# EAGLE design NovaHammyRevXD (EAGLE 7.4.0)
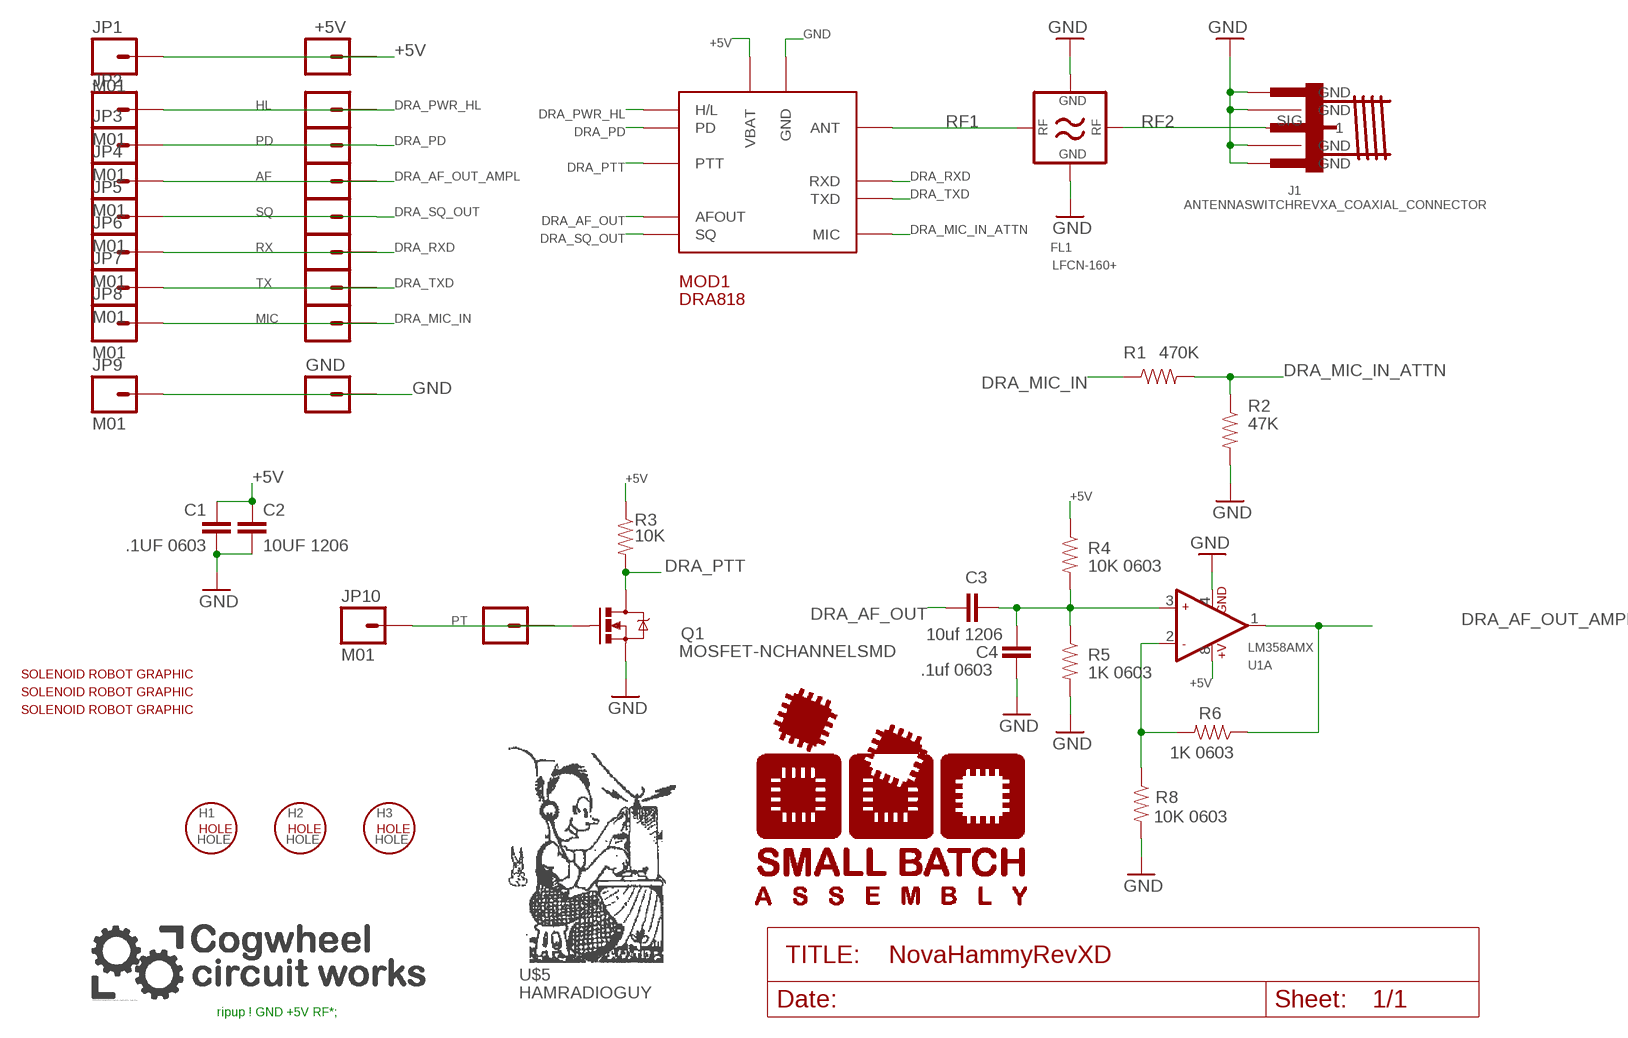
[diagram p0: schematic, sheet 1]

## Parts
5V  +5V  M01PTH_NO_SILK_YES_STOP  [1X01_NO_SILK]
AF  M01PTH_NO_SILK_YES_STOP  [1X01_NO_SILK]
C1  .1UF 0603  CAP0603  [0603]
C2  10UF 1206  CAP1206  [1206]
C3  10uf 1206  CAP1206  [1206]
C4  .1uf 0603  CAP0603  [0603]
FL1  LFCN-160+  LFCN-XXX  [FV1206]
GND  M01PTH_NO_SILK_YES_STOP  [1X01_NO_SILK]
H1  HOLE  [HOLE_3.3MM_M3_HEX_BOLT]
H2  HOLE  [HOLE_3.3MM_M3_HEX_BOLT]
H3  HOLE  [HOLE_3.3MM_M3_HEX_BOLT]
HL  M01PTH_NO_SILK_YES_STOP  [1X01_NO_SILK]
J1  ANTENNASWITCHREVXA_COAXIAL_CONNECTOR  [ANTENNASWITCHREVXA_SMA_JACK_EDGE_MOUNT]
JP1  M01  [1X01_SMT_2MM]
JP2  M01  [1X01_SMT_2MM]
JP3  M01  [1X01_SMT_2MM]
JP4  M01  [1X01_SMT_2MM]
JP5  M01  [1X01_SMT_2MM]
JP6  M01  [1X01_SMT_2MM]
JP7  M01  [1X01_SMT_2MM]
JP8  M01  [1X01_SMT_2MM]
JP9  M01  [1X01_SMT_2MM]
JP10  M01  [1X01_SMT_2MM]
MIC  M01PTH_NO_SILK_YES_STOP  [1X01_NO_SILK]
MOD1  DRA818  [DRA818]
PD  M01PTH_NO_SILK_YES_STOP  [1X01_NO_SILK]
PT  M01PTH_NO_SILK_YES_STOP  [1X01_NO_SILK]
Q1  MOSFET-NCHANNELSMD  [SOT23-3]
R1  470K  RES0603  [0603]
R2  47K  RES0603  [0603]
R3  10K  RES0603  [0603]
R4  10K 0603  RES0603  [0603]
R5  1K 0603  RES0603  [0603]
R6  1K 0603  RES0603  [0603]
R8  10K 0603  RES0603  [0603]
RX  M01PTH_NO_SILK_YES_STOP  [1X01_NO_SILK]
SQ  M01PTH_NO_SILK_YES_STOP  [1X01_NO_SILK]
TX  M01PTH_NO_SILK_YES_STOP  [1X01_NO_SILK]
U1  LM358AMX  LM358DR-1110010P1  [SOIC8]
U$1  SOLENOID_ROBOTSML  [SOLENOID_ROBOT]
U$2  SOLENOID_ROBOTSML  [SOLENOID_ROBOT]
U$3  SOLENOID_ROBOTSML  [SOLENOID_ROBOT]
U$4  SMALLBATCH_LOGOA  [SMALLBATCH_750W_V2]
U$5  HAMRADIOGUY  [HAMRADIO_3Q_INCH]
U$6  CWILOGO  [CWORKSLOGO_750MIL_WIDE_400DPI]

## Nets
+5V: 5V.1 C1.2 C2.1 JP1.P$1 MOD1.P$8(VBAT) R3.1 R4.1 U1.8(A:+V)
DRA_AF_OUT: C3.1 MOD1.P$3(AFOUT)
DRA_AF_OUT_AMPL: AF.1 JP4.P$1 R6.1 U1.1(A:OUT1)
DRA_MIC_IN: JP8.P$1 MIC.1 R1.1
DRA_MIC_IN_ATTN: MOD1.P$18(MIC) R1.2 R2.1
DRA_PD: JP3.P$1 MOD1.P$6(PD) PD.1
DRA_PTT: MOD1.P$5(PTT) Q1.3(D) R3.2
DRA_PWR_HL: HL.1 JP2.P$1 MOD1.P$7(H/L)
DRA_RXD: JP6.P$1 MOD1.P$16(RXD) RX.1
DRA_SQ_OUT: JP5.P$1 MOD1.P$1(SQ) SQ.1
DRA_TXD: JP7.P$1 MOD1.P$17(TXD) TX.1
GND: C1.1 C2.2 C4.2 FL1.2(GND2) FL1.4(GND1) FL1.6(GND1) FL1.7(GND1) FL1.8(GND1) FL1.9(GND1) FL1.11(GND2) FL1.12(GND2) FL1.13(GND2) FL1.14(GND2) GND.1 J1.G2(GND) J1.G3(GND) J1.G4(GND) J1.G(GND) JP9.P$1 MOD1.P$9(GND) MOD1.P$10(GND) Q1.2(S) R2.2 R5.2 R8.2 U1.4(A:GND)
N$1: C3.2 C4.1 R4.2 R5.1 U1.3(A:+IN1)
N$4: R6.2 R8.1 U1.2(A:-IN1)
N$6: JP10.P$1 PT.1 Q1.1(G)
RF1: FL1.1(IO1) MOD1.P$12(ANT)
RF2: FL1.3(IO2) J1.SIG
Unconnected: U1.5(B:+IN2) U1.6(B:-IN2) U1.7(B:OUT2)

## Notes on the sheet
- ripup ! GND +5V RF*;

## Library data of the parts
5V AF GND HL MIC PD PT RX SQ TX = mkr1000_dra818v_reva:M01: Header 1
C1 C4 = _cogwheel:CAP0603
C2 C3 = _cogwheel:CAP1206
FL1 = mkr1000_dra818v_reva:LFCN-XXX: CERAMIC LOW PASS FILTER
H1-H3 = MicroNovaDisplayRevA:HOLE
J1 = mkr1000_dra818v_reva:ANTENNASWITCHREVXA_COAXIAL_CONNECTOR
JP1-JP10 = MicroNovaDisplayRevA:M01: Header 1
MOD1 = mkr1000_dra818v_reva:DRA818
Q1 = _cogwheel:MOSFET-NCHANNEL
R1-R6 R8 = _cogwheel:RES0603
U1 = OPL Eagle Library:LM358DR: General purpose LOW Voltage, Rail-to-Rail Output Amplifiers http://www.fairchildsemi.com/ds/LM/LMV358.pdf
U$1-U$3 = _cogwheel:SOLENOID_ROBOT
U$4 = _cogwheel:SMALLBATCH_LOGO
U$5 = _cogwheel:HAMRADIOGUY
U$6 = _cogwheel:CWILOGO

## Net classes
1 pwrgnd: width 0.152 mm, drill 0.152 mm, clearance 0.152 mm

## Board
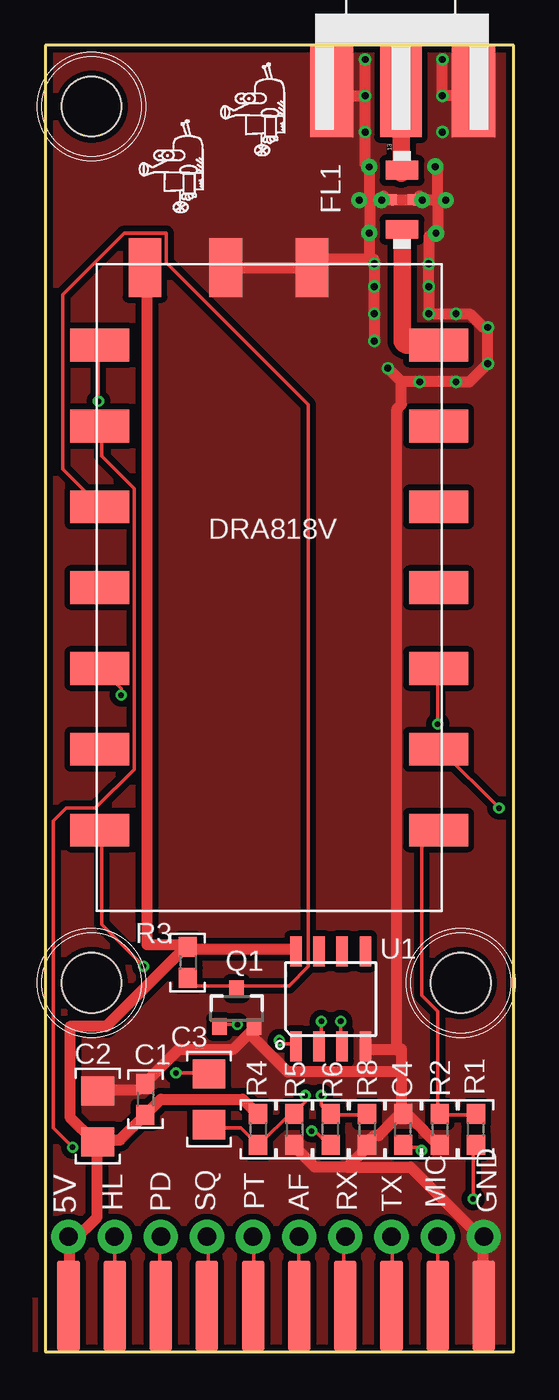
[diagram p1: board, top side]
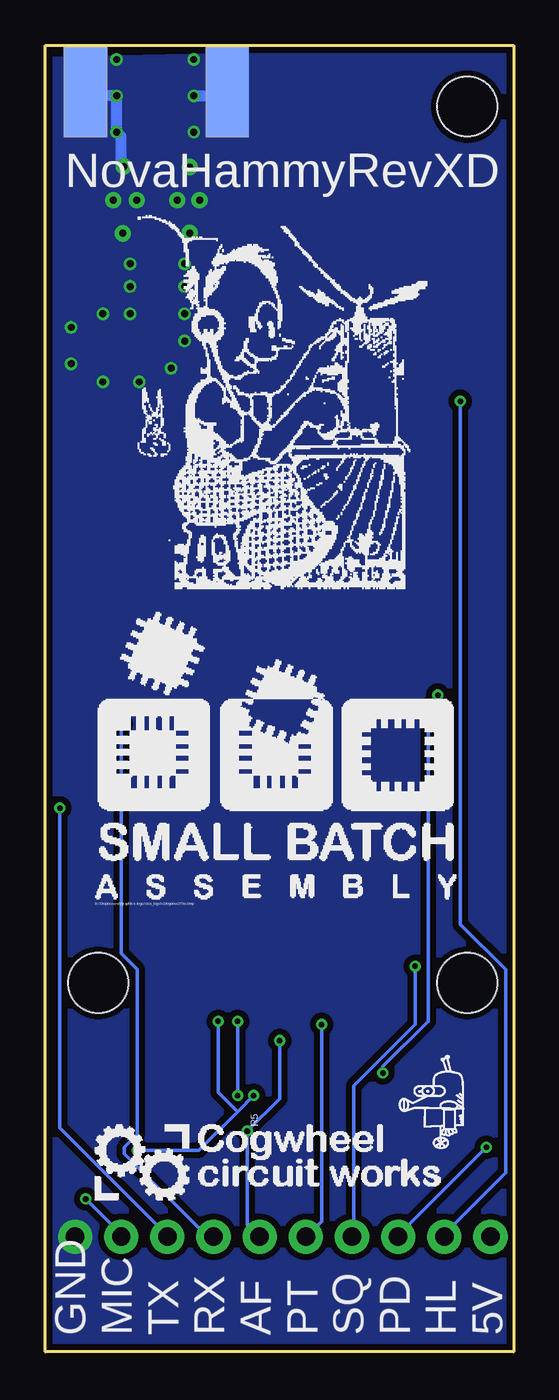
[diagram p2: board, bottom side, seen from below]

Size 25.77 x 71.95 mm. Coordinates in mm from the lower left corner, seen from the top.
Outline: 0,0 25.77,0 25.77,71.95 0,71.95 0,0
Copper layers (1*16): Top 0.035mm / dielectric 1.5mm / Bottom 0.035mm
Design rules "SeeedStudio_2layers *": minimum track width 8mil, minimum drill 12mil, track to track 6mil, track to pad 6mil, pad to pad 6mil, via to via 6mil, smd to smd 0mil, copper to edge 10mil, drill to drill 10mil, minimum pad ring 10mil, minimum via ring 6mil, stop-mask expansion 2mil, vias tented up to drill 100mil, thermal gap 10mil

### Footprints (pad centres in the part's own frame; a part is rotated, then mirrored left to right if it is on the bottom)
1X01_NO_SILK = drill 1.016 pad 1.88: 1 0,0
0603 = smd 1.1 x 1: 1 0.85,0; 2 -0.85,0
1206 = smd 1.6 x 1.8: 1 -1.4,0; 2 1.4,0
FV1206 = smd 1.04 x 1.8: 1 -1.61,0.002; 3 1.64,0.002 | smd 0.6 x 1: 2 0.015,-0.798; 4 0.015,0.802 | drill 0.381 pad 0.254: 6 -1.806,1.816; 7 0.005,1.132; 8 0.008,2.353; 9 0.001,-2.404; 11 -1.828,-1.866; 12 0.005,-1.1; 13 1.831,1.819; 14 1.854,-1.819
HOLE_3.3MM_M3_HEX_BOLT = hole 3.3: 0,0
ANTENNASWITCHREVXA_SMA_JACK_EDGE_MOUNT = smd 5 x 2.375 bottom: G 0,4; G2 0,-3.81 | smd 5 x 2.375: G3 0,-3.81; G4 0,4 | smd 5 x 2.29: SIG 0,0
1X01_SMT_2MM = smd 5 x 1.25: P$1 0,0
DRA818 = smd 3.25 x 1.8: P$1 -9.325,-13.35; P$2 -9.325,-8.9; P$3 -9.325,-4.45; P$4 -9.325,0; P$5 -9.325,4.45; P$6 -9.325,8.9; P$7 -9.325,13.35; P$12 9.325,13.35; P$13 9.325,8.9; P$14 9.325,4.45; P$15 9.325,0; P$16 9.325,-4.45; P$17 9.325,-8.9; P$18 9.325,-13.35 | smd 1.8 x 3.25: P$8 -6.84,17.625; P$9 -2.39,17.625; P$10 2.36,17.625
SOT23-3 = smd 0.8 x 0.9: 1 -0.95,-1; 2 0.95,-1; 3 0,1.1
SOIC8 = smd 1.651 x 0.635: 1 -2.616,1.905; 2 -2.616,0.635; 3 -2.616,-0.635; 4 -2.616,-1.905; 5 2.616,-1.905; 6 2.616,-0.635; 7 2.616,0.635; 8 2.616,1.905

### Placement (x,y rotation side)
5V  1.27,6.35 0 top
AF  13.97,6.35 0 top
C1  5.5,13.92 90 top
C2  2.88,12.98 90 top
C3  9,13.92 270 top
C4  19.7,12.26 270 top
FL1  19.63,63.42 90 top
GND  24.13,6.35 0 top
H1  2.54,68.58 0 top
H2  2.54,20.32 0 top
H3  22.86,20.32 0 top
HL  3.81,6.35 0 top
J1  19.56,69.4 270 top
JP1  1.27,2.54 90 top
JP2  3.81,2.54 90 top
JP3  6.35,2.54 90 top
JP4  13.97,2.54 90 top
JP5  8.89,2.54 90 top
JP6  16.51,2.54 90 top
JP7  19.05,2.54 90 top
JP8  21.59,2.54 90 top
JP9  24.13,2.54 90 top
JP10  11.43,2.54 90 top
MIC  21.59,6.35 0 top
MOD1  12.32,42.09 0 top
PD  6.35,6.35 0 top
PT  11.43,6.35 0 top
Q1  10.52,18.91 0 top
R1  23.7,12.26 270 top
R2  21.7,12.26 90 top
R3  7.83,21.45 90 top
R4  11.7,12.26 90 top
R5  13.7,12.26 90 top
R6  15.7,12.26 270 top
R8  17.7,12.26 90 top
RX  16.51,6.35 0 top
SQ  8.89,6.35 0 top
TX  19.05,6.35 0 top
U1  15.7,19.45 90 top
U$1  9.58,65.74 0 top
U$2  5.09,62.6 0 top
U$3  6.35,11.08 0 bottom
U$4  23.06,24.96 0 bottom
U$5  21.4,41.98 0 bottom
U$6  23.03,8.38 0 bottom

### Tracks (layer width: path | path; a pad name or v marks a point on that pad's centre or on a via)
+5V
  Top 0.61: C2.1 3.1,11.67 4.1,11.67 C1.2 6.35,13.92 10.85,13.92 11.6,13.17 R4.1 | JP1.P$1 1.35,2.67 1.35,6.17 5V.1 1.6,6.17 2.85,7.42 2.85,11.42 C2.1 | R3.1 7.85,22.17 13.6,22.17 U1.8 | MOD1.P$8 5.6,59.67 5.6,22.42 7.6,22.42 R3.1 | C2.1 2.6,11.67 1.35,12.92 1.35,17.92 3.35,17.92 7.6,22.17 R3.1
DRA_AF_OUT  (via drill 0.3)
  Top 0.203: v7.19,15.37 8.97,15.37 C3.1 | v4.17,36.17 4.17,36.52 3.1,37.59 MOD1.P$3
  Bottom 0.203: v7.19,15.37 7.19,15.72 4.7,18.21 4.7,35.64 v4.17,36.17
DRA_AF_OUT_AMPL  (via drill 0.3)
  Top 0.203: v14.66,12.17 14.83,12.17 15.54,11.46 R6.1 | v12.88,17.15 13.06,16.97 13.77,16.97 U1.1 | JP4.P$1 13.94,2.56 13.94,6.3 AF.1
  Bottom 0.203: AF.1 14.12,6.48 14.66,7.01 v14.66,12.17 12.88,13.94 v12.88,17.15
DRA_MIC_IN  (via drill 0.3)
  Top 0.203: v23.55,8.43 23.55,11.28 R1.1 | JP8.P$1 MIC.1
  Bottom 0.203: v23.55,8.43 21.59,6.48 MIC.1
DRA_MIC_IN_ATTN
  Top 0.203: R1.2 23.55,13.06 21.77,13.06 R2.1 21.59,13.23 21.59,18.74 20.7,19.63 20.7,27.81 21.59,28.7 MOD1.P$18
DRA_PD  (via drill 0.3)
  Top 0.203: v1.5,11.28 0.43,12.34 0.43,29.23 1.14,29.95 2.74,29.95 4.88,32.08 4.88,47.55 3.1,49.33 3.1,50.93 MOD1.P$6 | JP3.P$1 6.3,2.56 6.3,6.3 PD.1
  Bottom 0.203: v1.5,11.28 6.3,6.48 PD.1
DRA_PTT
  Top 0.203: R3.2 7.9,20.52 8.25,20.17 10.39,20.17 Q1.3 10.57,20.17 13.41,20.17 14.48,21.23 14.48,52.17 6.66,60 6.66,61.59 4.34,61.59 0.96,58.22 0.96,48.62 2.92,46.66 MOD1.P$5
DRA_PWR_HL  (via drill 0.3)
  Top 0.203: v2.92,52.35 2.92,55.37 MOD1.P$7 | HL.1 JP2.P$1
  Bottom 0.203: v2.92,52.35 2.92,23.55 0.43,21.06 0.43,9.86 3.81,6.48 HL.1
DRA_RXD  (via drill 0.3)
  Top 0.203: v21.59,34.57 21.59,37.59 MOD1.P$16 | JP6.P$1 16.43,2.56 16.43,6.3 RX.1
  Bottom 0.203: v21.59,34.57 21.59,21.95 20.7,21.06 20.7,11.99 21.41,11.28 21.41,10.92 16.97,6.48 16.61,6.48 RX.1
DRA_SQ_OUT  (via drill 0.3)
  Top 0.203: v5.41,21.23 3.1,23.55 3.1,28.7 MOD1.P$1 | JP5.P$1 8.97,2.56 8.97,6.3 SQ.1
  Bottom 0.203: v5.41,21.23 5.41,18.03 8.79,14.66 8.79,6.48 SQ.1
DRA_TXD  (via drill 0.3)
  Top 0.203: v24.97,29.95 21.77,33.15 MOD1.P$17 | JP7.P$1 19.1,2.56 19.1,6.3 TX.1
  Bottom 0.203: v24.97,29.95 24.97,12.34 19.1,6.48 TX.1
GND  (via drill 0.38)
  Top 0.61: J1.G4 23.35,69.17 v21.85,69.17 v21.85,71.17 | v17.6,69.17 15.85,69.17 J1.G2 | v17.6,69.17 v17.6,71.17 | MOD1.P$9 10.1,59.67 14.6,59.67 MOD1.P$10 14.85,59.92 15.1,60.17 17.85,60.17 | v18.1,55.67 v18.1,57.17 v18.1,58.67 v18.1,59.92 18.1,60.17 17.85,60.17 | 17.85,60.17 17.85,61.42 FL1.6 17.85,61.92 17.85,63.42 | 19.6,53.42 v18.85,54.17 | 19.6,53.42 v20.6,53.42 v22.6,53.42 23.35,53.42 v24.35,54.42 v24.35,56.42 24.1,56.42 23.35,57.17 v22.6,57.17 v21.1,57.17 v21.1,58.67 v21.1,59.92 21.1,61.42 21.35,61.42 FL1.11 21.6,61.67 21.6,63.42 | 17.85,63.42 17.35,63.42 FL1.8 | 17.85,63.42 18.35,63.42 FL1.7 18.6,63.67 FL1.4 19.1,63.42 20.35,63.42 FL1.12 | 17.85,63.42 17.85,65.17 FL1.13 17.6,65.42 v17.6,67.17 v17.6,69.17 | FL1.2 20.6,63.67 FL1.12 | 21.6,63.42 21.85,63.42 FL1.9 | 21.6,63.42 20.85,63.42 FL1.12 | 21.6,63.42 21.6,65.17 FL1.14 | JP9.P$1 24.1,2.67 24.1,6.17 GND.1 23.85,6.42 20.1,10.17 16.6,10.17 | 11.22,17.55 10.35,16.67 7.35,16.67 5.6,14.92 C1.1 5.35,14.67 5.1,14.42 3.1,14.42 C2.2 | 11.22,17.55 11.35,17.67 Q1.2 | 16.6,10.17 14.85,10.17 13.85,11.17 R5.2 | 16.6,10.17 17.6,11.17 R8.2 17.85,11.67 18.1,11.92 18.35,11.92 19.35,12.92 19.6,12.92 C4.2 | 19.6,15.42 19.6,16.67 19.35,16.67 | 19.6,15.42 19.6,13.17 C4.2 | 19.35,16.67 17.85,16.67 U1.4 | R2.2 21.6,11.42 20.1,12.92 19.85,12.92 C4.2 | 11.22,17.55 13.35,15.42 19.6,15.42 | 19.6,53.42 19.6,52.17 19.35,51.92 19.35,16.67
  Bottom 0.61: J1.G4 23.35,69.17 v21.85,69.17 v21.85,67.17 21.6,66.92 21.6,65.42 FL1.14 | v17.6,69.17 15.85,69.17 J1.G2
  pour Top (isolate 0.33, no thermals, hatched): -0.18,71.69 25.83,71.6 25.83,0.15 -0.5,0
  pour Bottom (isolate 0.33, no thermals, hatched): 0.32,71.69 25.4,71.12 25.9,0 -0.1,-0.36
N$1  (via drill 0.3)
  Top 0.203: v20.7,11.1 20.52,11.28 19.81,11.28 C4.1 | v14.3,14.12 14.3,13.77 13.77,13.23 R5.1 13.59,13.23 11.81,11.46 R4.2 11.63,11.46 10.74,12.34 9.14,12.34 C3.2 | v16.26,18.21 16.26,16.97 U1.3
  Bottom 0.203: v20.7,11.1 17.32,11.1 15.19,13.23 | v14.3,14.12 15.19,13.23 | v16.26,18.21 16.26,14.3 15.19,13.23
N$4  (via drill 0.3)
  Top 0.203: R8.1 17.68,13.06 15.72,13.06 R6.2 15.54,13.23 15.19,13.59 v15.19,14.12 | v15.19,18.21 15.19,16.97 U1.2
  Bottom 0.203: v15.19,14.12 v15.19,18.21
N$6  (via drill 0.3)
  Top 0.203: v10.57,18.03 9.68,18.03 Q1.1 | JP10.P$1 11.45,2.56 11.45,6.3 PT.1
  Bottom 0.203: v10.57,18.03 10.57,7.19 11.28,6.48 PT.1
RF1
  Top 0.965: MOD1.P$12 19.95,55.44 arc-90 19.63,55.76 FL1.1
RF2
  Top 0.61: 19.6,68.92 19.68,69.22 J1.SIG
  Top 0.965: FL1.3 arc90 19.6,65.03 | 19.6,65.03 19.6,64.92 | 19.6,65.03 19.6,68.92

### Text on the board
tPlace: DRA818V
bNames: GND / MIC / TX / RX / AF / PT / SQ / PD / HL / 5V